# EAGLE schematic NodeMCU_Weather_v_1.0 (EAGLE 9.6.2)
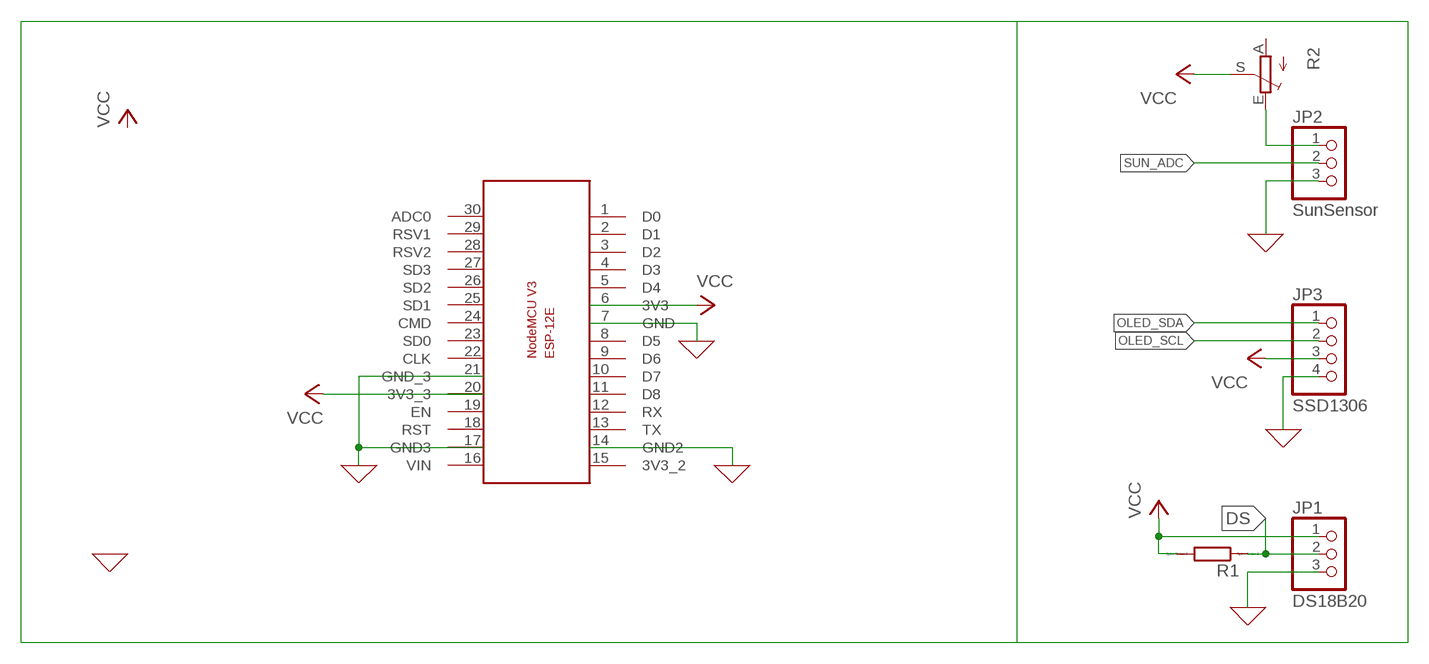
[diagram p0: schematic, sheet 1]

## Parts
JP1  DS18B20  PINHD-1X3  [1X03]
JP2  SunSensor  PINHD-1X3  [1X03]
JP3  SSD1306  PINHD-1X4  [1X04]
R1  R0204/7  [0204/7]
R2  TRIM_EU-B25P  [B25P]
U$1  NODEMCUESP8266  [NODEMCUESP8266]

## Nets
0: JP1.3 JP2.3 JP3.4 U$1.7(GND) U$1.14(GND2) U$1.17(GND3) U$1.21(GND_3) ; supply symbol labelled GND
DS: JP1.2 R1.1
N$2: JP2.1 R2.E
OLED_SCL: JP3.2
OLED_SDA: JP3.1
SUN_ADC: JP2.2
VCC: JP1.1 JP3.3 R1.2 R2.S U$1.6(3V3) U$1.20(3V3_3)
Unconnected: R2.A U$1.1(D0) U$1.2(D1) U$1.3(D2) U$1.4(D3) U$1.5(D4) U$1.8(D5) U$1.9(D6) U$1.10(D7) U$1.11(D8) U$1.12(RX) U$1.13(TX) U$1.15(3V3_2) U$1.16(VIN) U$1.18(RST) U$1.19(EN) U$1.22(CLK) U$1.23(SD0) U$1.24(CMD) U$1.25(SD1) U$1.26(SD2) U$1.27(SD3) U$1.28(RSV2) U$1.29(RSV1) U$1.30(ADC0)

## Library data of the parts
JP1 JP2 = pinhead:PINHD-1X3: PIN HEADER
JP3 = pinhead:PINHD-1X4: PIN HEADER
R1 = eagle-ltspice:R: RESISTOR, European symbol; SPICEMODEL: NONE; SPICEPREFIX: R
R2 = pot:TRIM_EU-: POTENTIOMETER
U$1 = NODEMCU:NODEMCUESP8266: Node Mcu esp8266 12E LIBRARY BY SDTECH ROBOTICS (Shubham Devkar Technology Solutions)